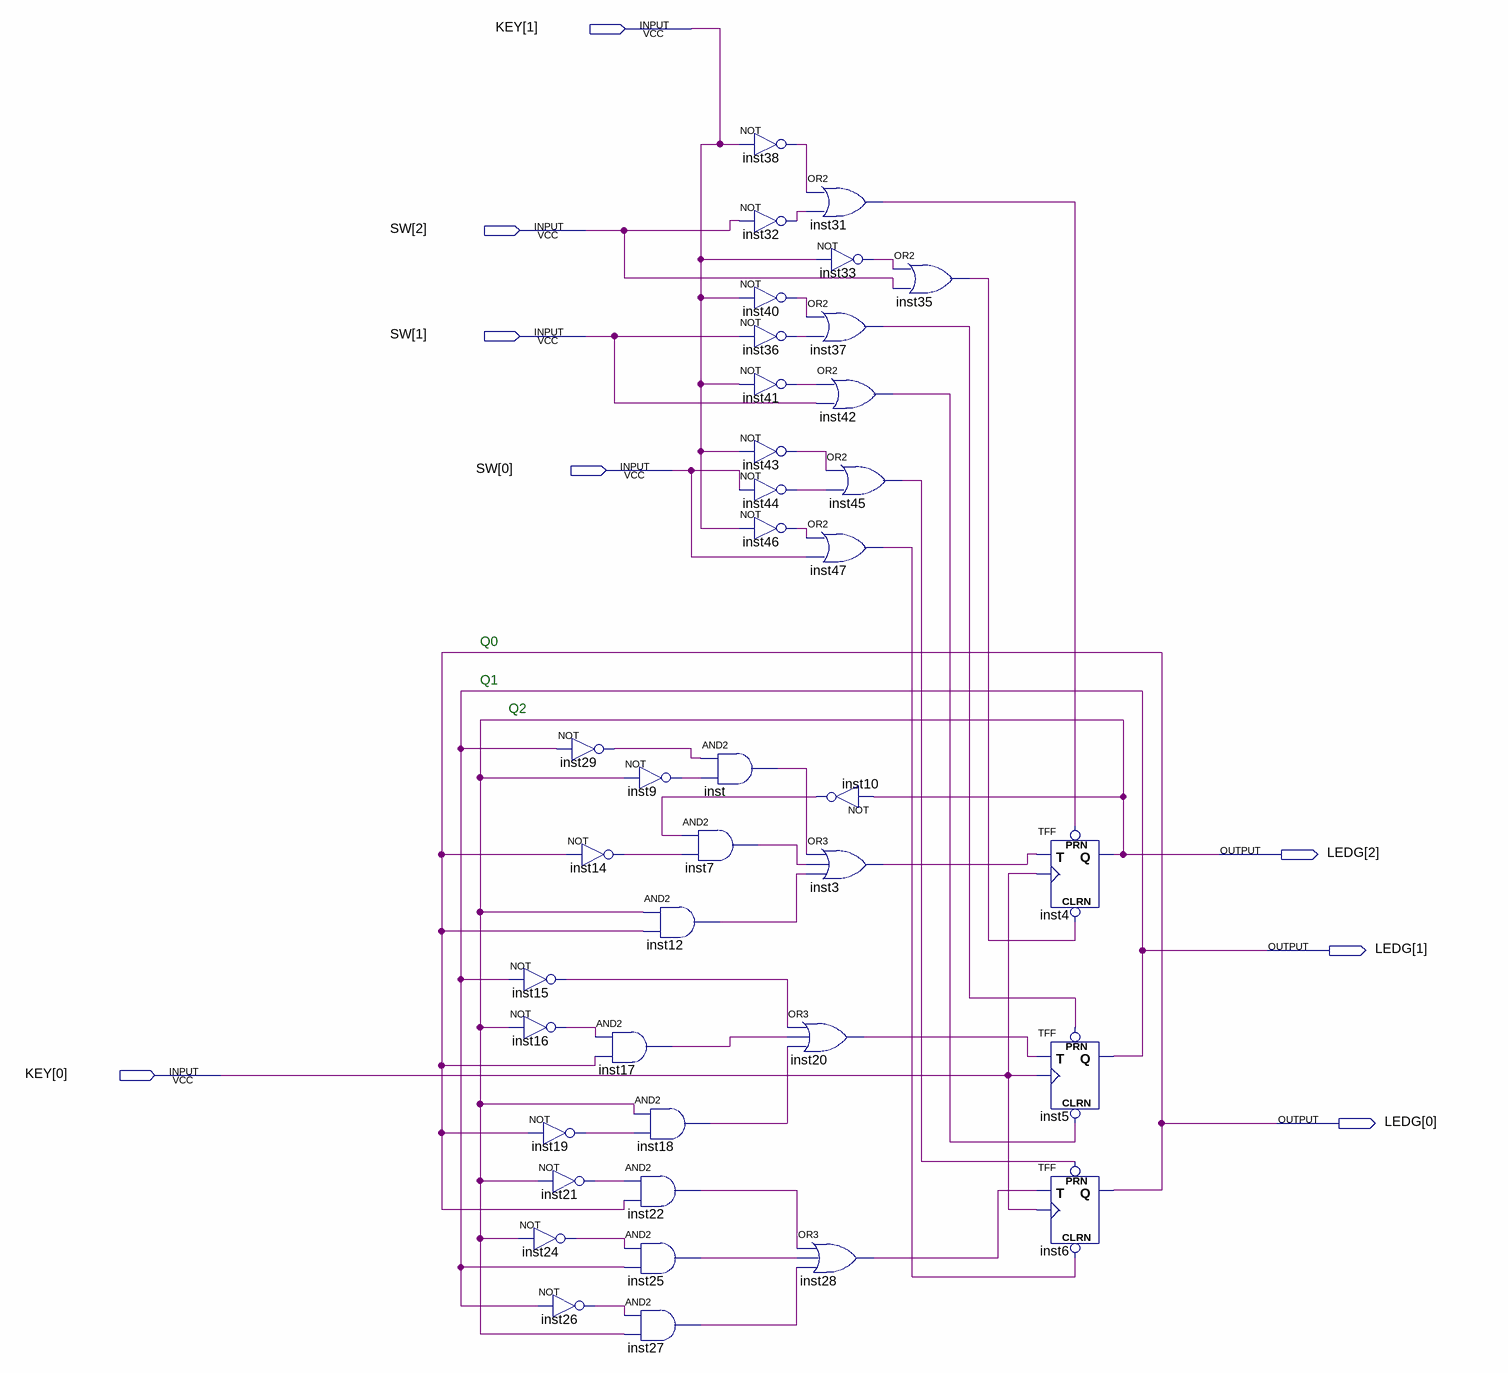
[diagram p0: schematic sheet]
// Quartus schematic Lab_1.bdf as structural Verilog: 39 symbols, 8 pins
module Lab_1 (
  input  [1:0] KEY,
  input  [2:0] SW,
  output [2:0] LEDG
);

  wire inst3_out, inst7_out, inst9_out, inst10_out, inst12_out, inst14_out, inst15_out, inst16_out,
       inst17_out, inst18_out, inst19_out, inst20_out, inst21_out, inst22_out, inst24_out, inst25_out,
       inst26_out, inst27_out, inst28_out, inst29_out, inst31_out, inst32_out, inst33_out, inst35_out,
       inst36_out, inst37_out, inst38_out, inst40_out, inst41_out, inst42_out, inst43_out, inst44_out,
       inst45_out, inst46_out, inst47_out, inst_out;

  not inst15 (inst15_out, LEDG[1]);
  not inst16 (inst16_out, LEDG[2]);
  not inst19 (inst19_out, LEDG[0]);
  not inst21 (inst21_out, LEDG[2]);
  not inst24 (inst24_out, LEDG[2]);
  not inst26 (inst26_out, LEDG[1]);
  not inst29 (inst29_out, LEDG[1]);
  not inst14 (inst14_out, LEDG[0]);
  and inst17 (inst17_out, inst16_out, LEDG[0]);
  not inst9 (inst9_out, LEDG[2]);
  and inst7 (inst7_out, inst10_out, inst14_out);
  and inst12 (inst12_out, LEDG[2], LEDG[0]);
  and inst18 (inst18_out, LEDG[2], inst19_out);
  and inst22 (inst22_out, inst21_out, LEDG[0]);
  and inst25 (inst25_out, inst24_out, LEDG[1]);
  and inst27 (inst27_out, inst26_out, LEDG[2]);
  not inst38 (inst38_out, KEY[1]);
  not inst32 (inst32_out, SW[2]);
  not inst40 (inst40_out, KEY[1]);
  not inst36 (inst36_out, SW[1]);
  not inst41 (inst41_out, KEY[1]);
  not inst43 (inst43_out, KEY[1]);
  not inst44 (inst44_out, SW[0]);
  not inst46 (inst46_out, KEY[1]);
  and inst (inst_out, inst29_out, inst9_out);
  or inst31 (inst31_out, inst38_out, inst32_out);
  not inst33 (inst33_out, KEY[1]);
  or inst37 (inst37_out, inst40_out, inst36_out);
  or inst42 (inst42_out, inst41_out, SW[1]);
  or inst45 (inst45_out, inst43_out, inst44_out);
  or inst47 (inst47_out, inst46_out, SW[0]);
  not inst10 (inst10_out, LEDG[2]);
  or inst3 (inst3_out, inst_out, inst7_out, inst12_out);
  or inst20 (inst20_out, inst15_out, inst17_out, inst18_out);
  or inst28 (inst28_out, inst22_out, inst25_out, inst27_out);
  or inst35 (inst35_out, inst33_out, SW[2]);
  TFF inst4 (.PRN(inst31_out), .CLRN(inst35_out), .T(inst3_out), .CLK(KEY[0]), .Q(LEDG[2]));
  TFF inst5 (.PRN(inst37_out), .CLRN(inst42_out), .T(inst20_out), .CLK(KEY[0]), .Q(LEDG[1]));
  TFF inst6 (.PRN(inst45_out), .CLRN(inst47_out), .T(inst28_out), .CLK(KEY[0]), .Q(LEDG[0]));

  // Notes on the sheet:
  //   Q0
  //   Q1
  //   Q2
endmodule
